# Altium project MaryLadder_8bits.PrjPcb
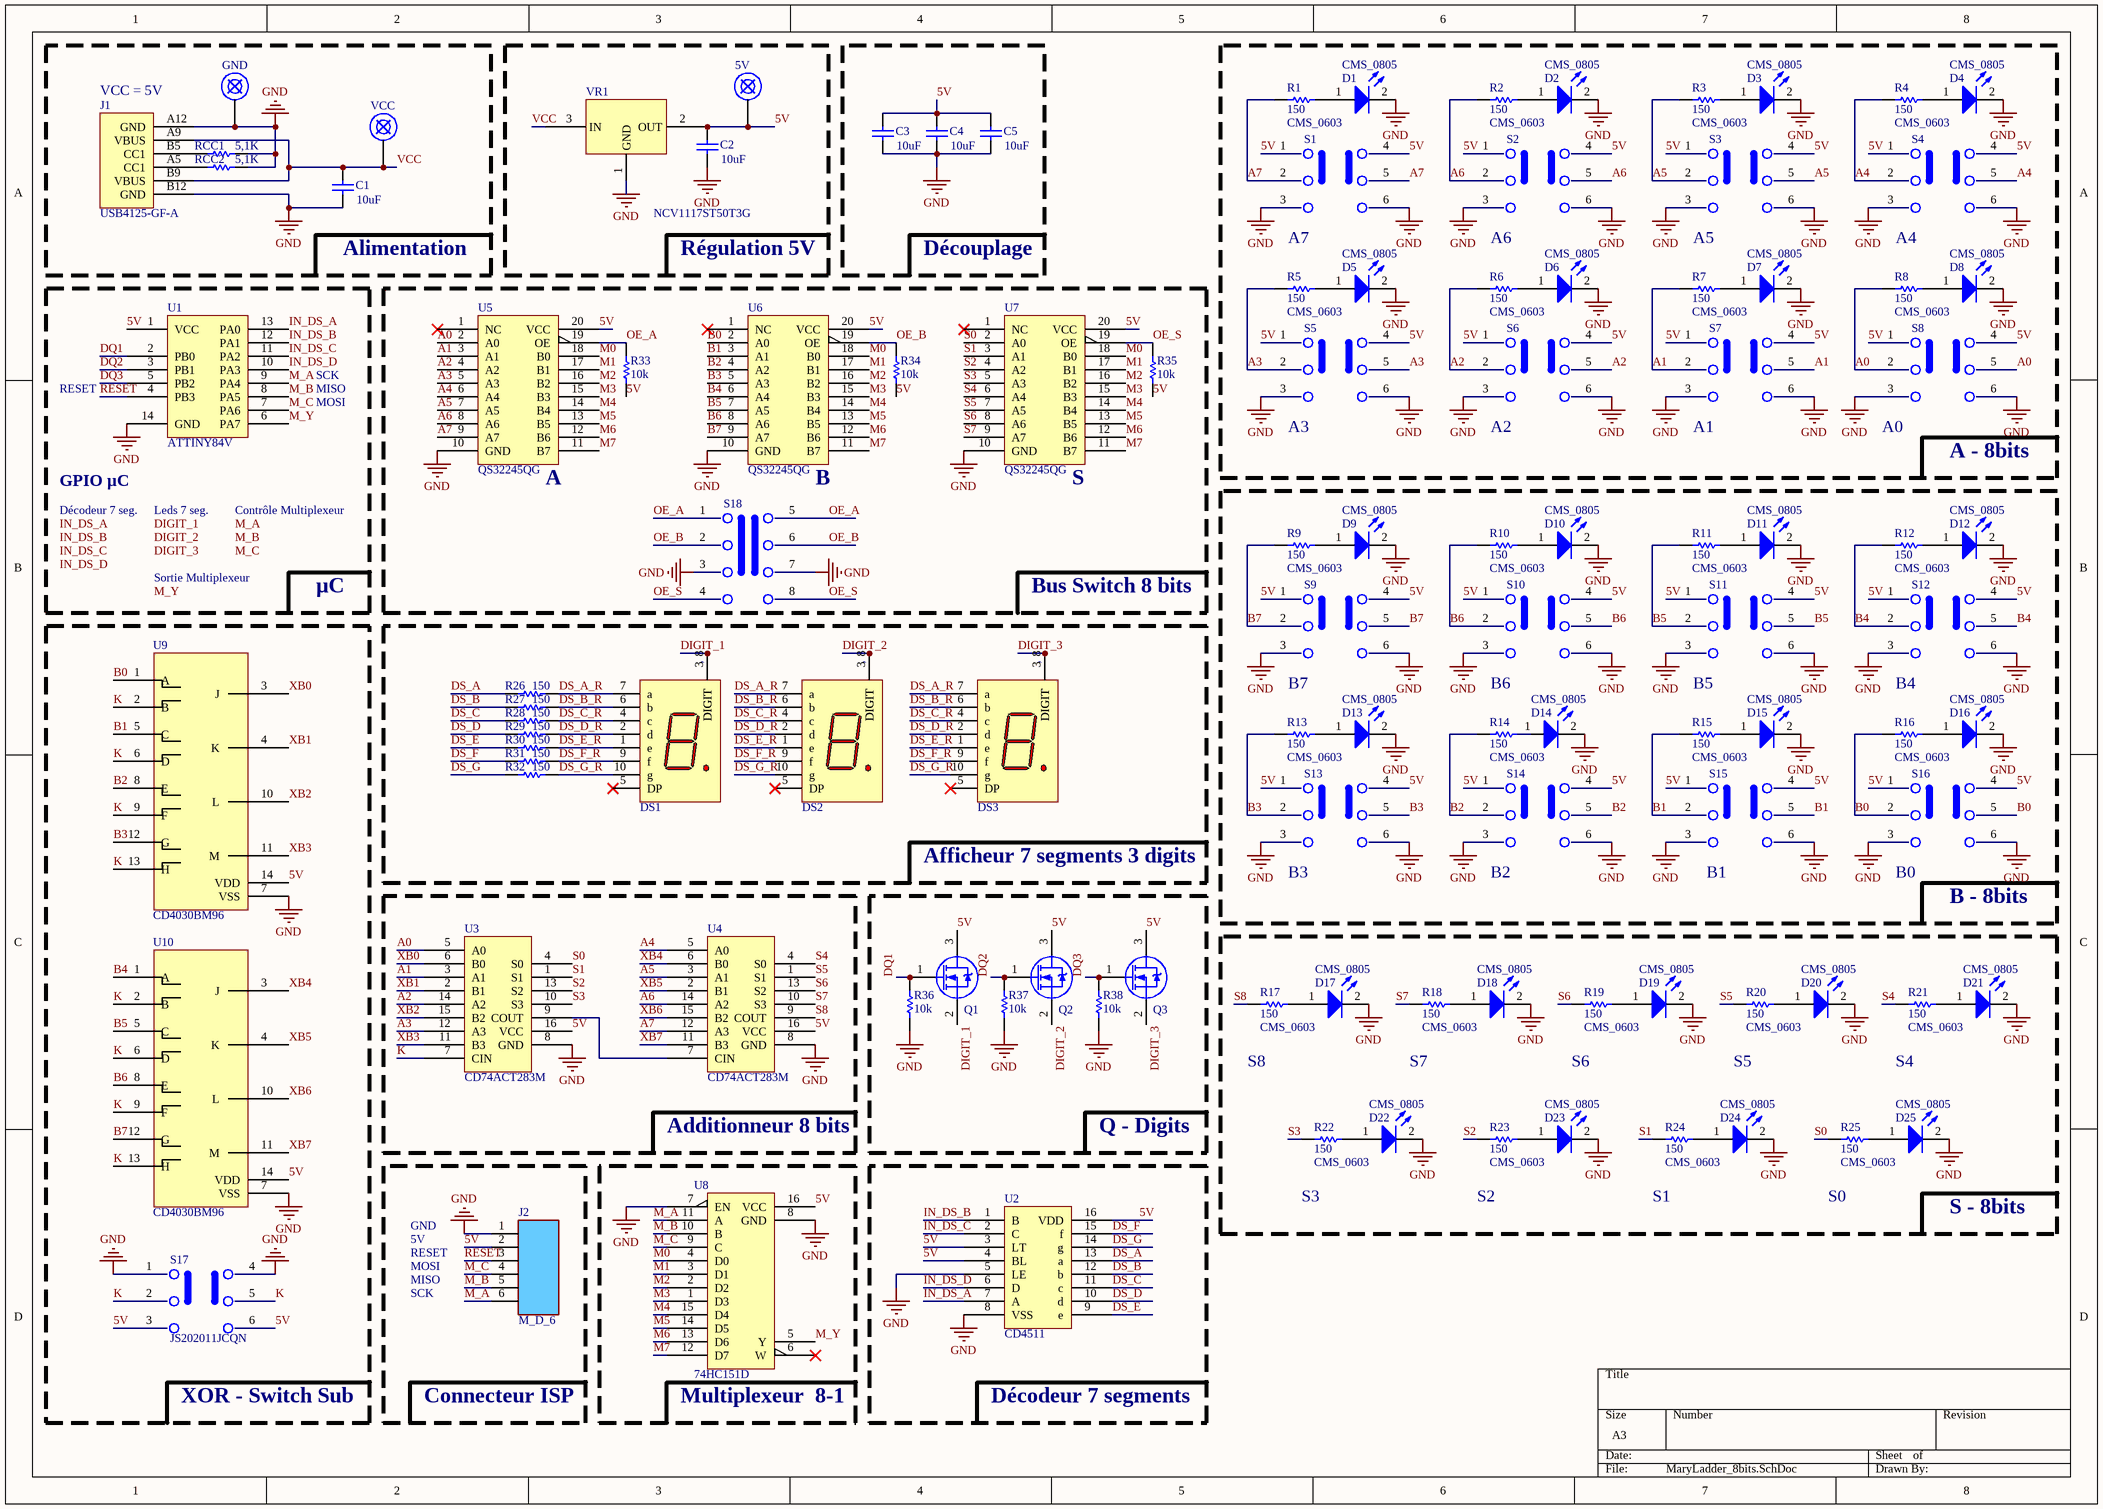
[diagram p0: MaryLadder_8bits.SchDoc]
1 sheet, 110 parts. Net scope: global (net labels, ports and power ports of the same name join across sheets).
Board file: MaryLadder_8bits.PcbDoc

## Sheet MaryLadder_8bits.SchDoc
size A3

### Parts
5V  POINT_TEST_CMS_2MM  [POINT_TEST_CMS_2MM]  (value not drawn)
C1  value 10uF  [CONDENSATEUR_CMS_0805]  (hidden comment: CMS_0805)
C2  value 10uF  [CONDENSATEUR_CMS_0805]  (hidden comment: CMS_0805)
C3  value 10uF  [CONDENSATEUR_CMS_0805]  (hidden comment: CMS_0805)
C4  value 10uF  [CONDENSATEUR_CMS_0805]  (hidden comment: CMS_0805)
C5  value 10uF  [CONDENSATEUR_CMS_0805]  (hidden comment: CMS_0805)
D1  Type: CMS_0805  [LED_CMS_0805]  (hidden comment: LED_CMS_0805)
D2  Type: CMS_0805  [LED_CMS_0805]  (hidden comment: LED_CMS_0805)
D3  Type: CMS_0805  [LED_CMS_0805]  (hidden comment: LED_CMS_0805)
D4  Type: CMS_0805  [LED_CMS_0805]  (hidden comment: LED_CMS_0805)
D5  Type: CMS_0805  [LED_CMS_0805]  (hidden comment: LED_CMS_0805)
D6  Type: CMS_0805  [LED_CMS_0805]  (hidden comment: LED_CMS_0805)
D7  Type: CMS_0805  [LED_CMS_0805]  (hidden comment: LED_CMS_0805)
D8  Type: CMS_0805  [LED_CMS_0805]  (hidden comment: LED_CMS_0805)
D9  Type: CMS_0805  [LED_CMS_0805]  (hidden comment: LED_CMS_0805)
D10  Type: CMS_0805  [LED_CMS_0805]  (hidden comment: LED_CMS_0805)
D11  Type: CMS_0805  [LED_CMS_0805]  (hidden comment: LED_CMS_0805)
D12  Type: CMS_0805  [LED_CMS_0805]  (hidden comment: LED_CMS_0805)
D13  Type: CMS_0805  [LED_CMS_0805]  (hidden comment: LED_CMS_0805)
D14  Type: CMS_0805  [LED_CMS_0805]  (hidden comment: LED_CMS_0805)
D15  Type: CMS_0805  [LED_CMS_0805]  (hidden comment: LED_CMS_0805)
D16  Type: CMS_0805  [LED_CMS_0805]  (hidden comment: LED_CMS_0805)
D17  Type: CMS_0805  [LED_CMS_0805]  (hidden comment: LED_CMS_0805)
D18  Type: CMS_0805  [LED_CMS_0805]  (hidden comment: LED_CMS_0805)
D19  Type: CMS_0805  [LED_CMS_0805]  (hidden comment: LED_CMS_0805)
D20  Type: CMS_0805  [LED_CMS_0805]  (hidden comment: LED_CMS_0805)
D21  Type: CMS_0805  [LED_CMS_0805]  (hidden comment: LED_CMS_0805)
D22  Type: CMS_0805  [LED_CMS_0805]  (hidden comment: LED_CMS_0805)
D23  Type: CMS_0805  [LED_CMS_0805]  (hidden comment: LED_CMS_0805)
D24  Type: CMS_0805  [LED_CMS_0805]  (hidden comment: LED_CMS_0805)
D25  Type: CMS_0805  [LED_CMS_0805]  (hidden comment: LED_CMS_0805)
DS1  AFFICHEUR_7_SEGM_A.C_1_DIGIT  [AFFICHEUR_7_SEGM_A.C_1_DIGIT]  (value not drawn)
DS2  AFFICHEUR_7_SEGM_A.C_1_DIGIT  [AFFICHEUR_7_SEGM_A.C_1_DIGIT]  (value not drawn)
DS3  AFFICHEUR_7_SEGM_A.C_1_DIGIT  [AFFICHEUR_7_SEGM_A.C_1_DIGIT]  (value not drawn)
GND  POINT_TEST_CMS_2MM  [POINT_TEST_CMS_2MM]  (value not drawn)
J1  USB4125-GF-A  [TYPE-C FEMELLE]
J2  Type: M_D_6  [BARRETTE_6_M_D]  (hidden comment: BARRETTE_6 CONTACTS_1 RANGEE_MALE_DROITE)
Q1  TRANSISTOR_MOSFET-N_SOT23_GSD  [TRANSISTOR_MOSFET-N_SOT23_GSD]  (value not drawn)
Q2  TRANSISTOR_MOSFET-N_SOT23_GSD  [TRANSISTOR_MOSFET-N_SOT23_GSD]  (value not drawn)
Q3  TRANSISTOR_MOSFET-N_SOT23_GSD  [TRANSISTOR_MOSFET-N_SOT23_GSD]  (value not drawn)
R1  value 150  Type: CMS_0603  [RESISTANCE_CMS_0603]  (hidden comment: RESISTANCE_CMS_0603)
R2  value 150  Type: CMS_0603  [RESISTANCE_CMS_0603]  (hidden comment: RESISTANCE_CMS_0603)
R3  value 150  Type: CMS_0603  [RESISTANCE_CMS_0603]  (hidden comment: RESISTANCE_CMS_0603)
R4  value 150  Type: CMS_0603  [RESISTANCE_CMS_0603]  (hidden comment: RESISTANCE_CMS_0603)
R5  value 150  Type: CMS_0603  [RESISTANCE_CMS_0603]  (hidden comment: RESISTANCE_CMS_0603)
R6  value 150  Type: CMS_0603  [RESISTANCE_CMS_0603]  (hidden comment: RESISTANCE_CMS_0603)
R7  value 150  Type: CMS_0603  [RESISTANCE_CMS_0603]  (hidden comment: RESISTANCE_CMS_0603)
R8  value 150  Type: CMS_0603  [RESISTANCE_CMS_0603]  (hidden comment: RESISTANCE_CMS_0603)
R9  value 150  Type: CMS_0603  [RESISTANCE_CMS_0603]  (hidden comment: RESISTANCE_CMS_0603)
R10  value 150  Type: CMS_0603  [RESISTANCE_CMS_0603]  (hidden comment: RESISTANCE_CMS_0603)
R11  value 150  Type: CMS_0603  [RESISTANCE_CMS_0603]  (hidden comment: RESISTANCE_CMS_0603)
R12  value 150  Type: CMS_0603  [RESISTANCE_CMS_0603]  (hidden comment: RESISTANCE_CMS_0603)
R13  value 150  Type: CMS_0603  [RESISTANCE_CMS_0603]  (hidden comment: RESISTANCE_CMS_0603)
R14  value 150  Type: CMS_0603  [RESISTANCE_CMS_0603]  (hidden comment: RESISTANCE_CMS_0603)
R15  value 150  Type: CMS_0603  [RESISTANCE_CMS_0603]  (hidden comment: RESISTANCE_CMS_0603)
R16  value 150  Type: CMS_0603  [RESISTANCE_CMS_0603]  (hidden comment: RESISTANCE_CMS_0603)
R17  value 150  Type: CMS_0603  [RESISTANCE_CMS_0603]  (hidden comment: RESISTANCE_CMS_0603)
R18  value 150  Type: CMS_0603  [RESISTANCE_CMS_0603]  (hidden comment: RESISTANCE_CMS_0603)
R19  value 150  Type: CMS_0603  [RESISTANCE_CMS_0603]  (hidden comment: RESISTANCE_CMS_0603)
R20  value 150  Type: CMS_0603  [RESISTANCE_CMS_0603]  (hidden comment: RESISTANCE_CMS_0603)
R21  value 150  Type: CMS_0603  [RESISTANCE_CMS_0603]  (hidden comment: RESISTANCE_CMS_0603)
R22  value 150  Type: CMS_0603  [RESISTANCE_CMS_0603]  (hidden comment: RESISTANCE_CMS_0603)
R23  value 150  Type: CMS_0603  [RESISTANCE_CMS_0603]  (hidden comment: RESISTANCE_CMS_0603)
R24  value 150  Type: CMS_0603  [RESISTANCE_CMS_0603]  (hidden comment: RESISTANCE_CMS_0603)
R25  value 150  Type: CMS_0603  [RESISTANCE_CMS_0603]  (hidden comment: RESISTANCE_CMS_0603)
R26  value 150  [RESISTANCE_CMS_0603]  (hidden comment: RESISTANCE_CMS_0603)
R27  value 150  [RESISTANCE_CMS_0603]  (hidden comment: RESISTANCE_CMS_0603)
R28  value 150  [RESISTANCE_CMS_0603]  (hidden comment: RESISTANCE_CMS_0603)
R29  value 150  [RESISTANCE_CMS_0603]  (hidden comment: RESISTANCE_CMS_0603)
R30  value 150  [RESISTANCE_CMS_0603]  (hidden comment: RESISTANCE_CMS_0603)
R31  value 150  [RESISTANCE_CMS_0603]  (hidden comment: RESISTANCE_CMS_0603)
R32  value 150  [RESISTANCE_CMS_0603]  (hidden comment: RESISTANCE_CMS_0603)
R33  value 10k  [RESISTANCE_CMS_0603]  (hidden comment: RESISTANCE_CMS_0603)
R34  value 10k  [RESISTANCE_CMS_0603]  (hidden comment: RESISTANCE_CMS_0603)
R35  value 10k  [RESISTANCE_CMS_0603]  (hidden comment: RESISTANCE_CMS_0603)
R36  value 10k  [RESISTANCE_CMS_0603]  (hidden comment: RESISTANCE_CMS_0603)
R37  value 10k  [RESISTANCE_CMS_0603]  (hidden comment: RESISTANCE_CMS_0603)
R38  value 10k  [RESISTANCE_CMS_0603]  (hidden comment: RESISTANCE_CMS_0603)
RCC1  value 5,1K  [RESISTANCE_CMS_0603]  (hidden comment: RESISTANCE_CMS_0603)
RCC2  value 5,1K  [RESISTANCE_CMS_0603]  (hidden comment: RESISTANCE_CMS_0603)
S1  JS202011JCQN  [JS202011JCQN]  (value not drawn)
S2  JS202011JCQN  [JS202011JCQN]  (value not drawn)
S3  JS202011JCQN  [JS202011JCQN]  (value not drawn)
S4  JS202011JCQN  [JS202011JCQN]  (value not drawn)
S5  JS202011JCQN  [JS202011JCQN]  (value not drawn)
S6  JS202011JCQN  [JS202011JCQN]  (value not drawn)
S7  JS202011JCQN  [JS202011JCQN]  (value not drawn)
S8  JS202011JCQN  [JS202011JCQN]  (value not drawn)
S9  JS202011JCQN  [JS202011JCQN]  (value not drawn)
S10  JS202011JCQN  [JS202011JCQN]  (value not drawn)
S11  JS202011JCQN  [JS202011JCQN]  (value not drawn)
S12  JS202011JCQN  [JS202011JCQN]  (value not drawn)
S13  JS202011JCQN  [JS202011JCQN]  (value not drawn)
S14  JS202011JCQN  [JS202011JCQN]  (value not drawn)
S15  JS202011JCQN  [JS202011JCQN]  (value not drawn)
S16  JS202011JCQN  [JS202011JCQN]  (value not drawn)
S17  JS202011JCQN  [JS202011JCQN]
S18  JS203011JCQN  [JS203011JCQN]  (value not drawn)
U1  ATTINY84V  [ATTINY84V-10SSU]
U2  CD4511  [CD4511]
U3  CD74ACT283M  [CD74ACT283M]
U4  CD74ACT283M  [CD74ACT283M]
U5  QS32245QG  [QS32245QG]
U6  QS32245QG  [QS32245QG]
U7  QS32245QG  [QS32245QG]
U8  74HC151D  [74HC151D]
U9  CD4030BM96  [CD4030BM96]
U10  CD4030BM96  [CD4030BM96]
VCC  POINT_TEST_CMS_2MM  [POINT_TEST_CMS_2MM]  (value not drawn)
VR1  NCV1117ST50T3G  [NCV1117ST50T3G]

### Blocks framed on the sheet
Alimentation: C1 GND J1 RCC1 RCC2 VCC
Régulation 5V: 5V C2 VR1
Découplage: C3-C5
A - 8bits: D1-D8 R1-R8 S1-S8
µC: U1
B - 8bits: D9-D16 R9-R16 S9-S16
XOR - Switch Sub: S17 U9 U10
Afficheur 7 segments 3 digits: DS1-DS3 R26-R32
Additionneur 8 bits: U3 U4
Q - Digits: Q1-Q3 R36-R38
S - 8bits: D17-D25 R17-R25
Connecteur ISP: J2
Multiplexeur  8-1: U8
Décodeur 7 segments: U2

### Nets
GND: C1.1 C2.1 C3.1 C4.1 C5.1 D1.2 D2.2 D3.2 D4.2 D5.2 D6.2 D7.2 D8.2 D9.2 D10.2 D11.2 D12.2 D13.2 D14.2 D15.2 D16.2 D17.2 D18.2 D19.2 D20.2 D21.2 D22.2 D23.2 D24.2 D25.2 GND.1 J1.A12(GND) J1.B12(GND) J2.1 R36.1 R37.1 R38.1 RCC1.2 RCC2.2 S1.3 S1.6 S2.3 S2.6 S3.3 S3.6 S4.3 S4.6 S5.3 S5.6 S6.3 S6.6 S7.3 S7.6 S8.3 S8.6 S9.3 S9.6 S10.3 S10.6 S11.3 S11.6 S12.3 S12.6 S13.3 S13.6 S14.3 S14.6 S15.3 S15.6 S16.3 S16.6 S17.1 S17.4 S18.3 S18.7 U1.14(GND) U2.5(LE) U2.8(VSS) U3.8(GND) U4.8(GND) U5.10(GND) U6.10(GND) U7.10(GND) U8.7(EN) U8.8(GND) U9.7(VSS) U10.7(VSS) VR1.1(GND)
5V: 5V.1 C2.2 C3.2 C4.2 C5.2 J2.2 Q1.3(D) Q2.3(D) Q3.3(D) R33.1 R34.1 R35.1 S1.1 S1.4 S2.1 S2.4 S3.1 S3.4 S4.1 S4.4 S5.1 S5.4 S6.1 S6.4 S7.1 S7.4 S8.1 S8.4 S9.1 S9.4 S10.1 S10.4 S11.1 S11.4 S12.1 S12.4 S13.1 S13.4 S14.1 S14.4 S15.1 S15.4 S16.1 S16.4 S17.3 S17.6 U1.1(VCC) U2.3(LT) U2.4(BL) U2.16(VDD) U3.16(VCC) U4.16(VCC) U5.20(VCC) U6.20(VCC) U7.20(VCC) U8.16(VCC) U9.14(VDD) U10.14(VDD) VR1.2(OUT)
A0: R8.1 S8.2 S8.5 U3.5(A0) U5.2(A0)
A1: R7.1 S7.2 S7.5 U3.3(A1) U5.3(A1)
A2: R6.1 S6.2 S6.5 U3.14(A2) U5.4(A2)
A3: R5.1 S5.2 S5.5 U3.12(A3) U5.5(A3)
A4: R4.1 S4.2 S4.5 U4.5(A0) U5.6(A4)
A5: R3.1 S3.2 S3.5 U4.3(A1) U5.7(A5)
A6: R2.1 S2.2 S2.5 U4.14(A2) U5.8(A6)
A7: R1.1 S1.2 S1.5 U4.12(A3) U5.9(A7)
B0: R16.1 S16.2 S16.5 U6.2(A0) U9.1(A)
B1: R15.1 S15.2 S15.5 U6.3(A1) U9.5(C)
B2: R14.1 S14.2 S14.5 U6.4(A2) U9.8(E)
B3: R13.1 S13.2 S13.5 U6.5(A3) U9.12(G)
B4: R12.1 S12.2 S12.5 U6.6(A4) U10.1(A)
B5: R11.1 S11.2 S11.5 U6.7(A5) U10.5(C)
B6: R10.1 S10.2 S10.5 U6.8(A6) U10.8(E)
B7: R9.1 S9.2 S9.5 U6.9(A7) U10.12(G)
DIGIT_1: DS1.3(DIGIT) DS1.8(DIGIT) Q1.2(S)
DIGIT_2: DS2.3(DIGIT) DS2.8(DIGIT) Q2.2(S)
DIGIT_3: DS3.3(DIGIT) DS3.8(DIGIT) Q3.2(S)
DQ1: Q1.1(G) R36.2 U1.2(PB0)
DQ2: Q2.1(G) R37.2 U1.3(PB1)
DQ3: Q3.1(G) R38.2 U1.5(PB2)
DS_A: R26.1 U2.13(a)
DS_A_R: DS1.7(a) DS2.7(a) DS3.7(a) R26.2
DS_B: R27.1 U2.12(b)
DS_B_R: DS1.6(b) DS2.6(b) DS3.6(b) R27.2
DS_C: R28.1 U2.11(c)
DS_C_R: DS1.4(c) DS2.4(c) DS3.4(c) R28.2
DS_D: R29.1 U2.10(d)
DS_D_R: DS1.2(d) DS2.2(d) DS3.2(d) R29.2
DS_E: R30.1 U2.9(e)
DS_E_R: DS1.1(e) DS2.1(e) DS3.1(e) R30.2
DS_F: R31.1 U2.15(f)
DS_F_R: DS1.9(f) DS2.9(f) DS3.9(f) R31.2
DS_G: R32.1 U2.14(g)
DS_G_R: DS1.10(g) DS2.10(g) DS3.10(g) R32.2
IN_DS_A: U1.13(PA0) U2.7(A)
IN_DS_B: U1.12(PA1) U2.1(B)
IN_DS_C: U1.11(PA2) U2.2(C)
IN_DS_D: U1.10(PA3) U2.6(D)
K: S17.2 S17.5 U3.7(CIN) U9.2(B) U9.6(D) U9.9(F) U9.13(H) U10.2(B) U10.6(D) U10.9(F) U10.13(H)
M0: U5.18(B0) U6.18(B0) U7.18(B0) U8.4(D0)
M1: U5.17(B1) U6.17(B1) U7.17(B1) U8.3(D1)
M2: U5.16(B2) U6.16(B2) U7.16(B2) U8.2(D2)
M3: U5.15(B3) U6.15(B3) U7.15(B3) U8.1(D3)
M4: U5.14(B4) U6.14(B4) U7.14(B4) U8.15(D4)
M5: U5.13(B5) U6.13(B5) U7.13(B5) U8.14(D5)
M6: U5.12(B6) U6.12(B6) U7.12(B6) U8.13(D6)
M7: U5.11(B7) U6.11(B7) U7.11(B7) U8.12(D7)
M_A: J2.6 U1.9(PA4) U8.11(A)
M_B: J2.5 U1.8(PA5) U8.10(B)
M_C: J2.4 U1.7(PA6) U8.9(C)
M_Y: U1.6(PA7) U8.5(Y)
OE_A: R33.2 S18.1 S18.5 U5.19(OE)
OE_B: R34.2 S18.2 S18.6 U6.19(OE)
OE_S: R35.2 S18.4 S18.8 U7.19(OE)
RESET: J2.3 U1.4(PB3)
S0: R25.1 U3.4(S0) U7.2(A0)
S1: R24.1 U3.1(S1) U7.3(A1)
S2: R23.1 U3.13(S2) U7.4(A2)
S3: R22.1 U3.10(S3) U7.5(A3)
S4: R21.1 U4.4(S0) U7.6(A4)
S5: R20.1 U4.1(S1) U7.7(A5)
S6: R19.1 U4.13(S2) U7.8(A6)
S7: R18.1 U4.10(S3) U7.9(A7)
S8: R17.1 U4.9(COUT)
VCC: C1.2 J1.A9(VBUS) J1.B9(VBUS) VCC.1 VR1.3(IN)
XB0: U3.6(B0) U9.3(J)
XB1: U3.2(B1) U9.4(K)
XB2: U3.15(B2) U9.10(L)
XB3: U3.11(B3) U9.11(M)
XB4: U4.6(B0) U10.3(J)
XB5: U4.2(B1) U10.4(K)
XB6: U4.15(B2) U10.10(L)
XB7: U4.11(B3) U10.11(M)
NetD1_1: D1.1 R1.2
NetD2_1: D2.1 R2.2
NetD3_1: D3.1 R3.2
NetD4_1: D4.1 R4.2
NetD5_1: D5.1 R5.2
NetD6_1: D6.1 R6.2
NetD7_1: D7.1 R7.2
NetD8_1: D8.1 R8.2
NetD9_1: D9.1 R9.2
NetD10_1: D10.1 R10.2
NetD11_1: D11.1 R11.2
NetD12_1: D12.1 R12.2
NetD13_1: D13.1 R13.2
NetD14_1: D14.1 R14.2
NetD15_1: D15.1 R15.2
NetD16_1: D16.1 R16.2
NetD17_1: D17.1 R17.2
NetD18_1: D18.1 R18.2
NetD19_1: D19.1 R19.2
NetD20_1: D20.1 R20.2
NetD21_1: D21.1 R21.2
NetD22_1: D22.1 R22.2
NetD23_1: D23.1 R23.2
NetD24_1: D24.1 R24.2
NetD25_1: D25.1 R25.2
NetJ1_A5: J1.A5(CC1) RCC2.1
NetJ1_B5: J1.B5(CC1) RCC1.1
NetU3_9: U3.9(COUT) U4.7(CIN)

Not connected (* = marked no-connect by the designer): DS1 5(DP)*; DS2 5(DP)*; DS3 5(DP)*; U5 1(NC)*; U6 1(NC)*; U7 1(NC)*; U8 6(W)*

### Notes on the sheet
- (near J1) VCC = 5V
- (near S1) A7
- (near S2) A6
- (near S3) A5
- (near S4) A4
- SCK
- RESET
- MISO
- MOSI
- (near S5) A3
- (near S6) A2
- (near S7) A1
- (near S8) A0
- GPIO µC
- Décodeur 7 seg.
- Leds 7 seg.
- Contrôle Multiplexeur
- (near U5) A
- B
- (near U7) S
- Sortie Multiplexeur
- Bus Switch 8 bits
- (near S9) B7
- (near S10) B6
- (near S11) B5
- (near S12) B4
- (near S13) B3
- (near S14) B2
- (near S15) B1
- (near S16) B0
- (near R17) S8
- S7
- S6
- S5
- S4
- 5V
- GND
- (near R22) S3
- (near R23) S2
- (near R24) S1
- (near R25) S0
- Labels drawn without touching a wire or pin: DIGIT_1, DIGIT_2, DIGIT_3, IN_DS_A, IN_DS_B, IN_DS_C, IN_DS_D, M_A, M_B, M_C, M_Y
- (in symbol AFFICHEUR_7_SEGM_A.C_1_DIGIT) ,

### Library data of the parts
C1-C5 = CONDENSATEUR_CMS_CER_0805: CONDENSATEUR CMS CERAMIQUE 0805; Type: CMS_0805
D1-D25 = LED_CMS_0805: LED CMS 0805
DS1-DS3 = AFFICHEUR_7_SEGM_A.C_1_DIGIT: VDMR10A1 - DISPLAY 7SEG 0.39" SGL RED 10SMD; Type: SMD-10
J1 = TYPE-C FEMELLE: CONN RCPT TYPE C 6P SMD RA
J2 = BARRETTE_6 CONTACTS_1 RANGEE_MALE_DROITE: BARRETTE 6 CONTACTS 1 RANGEE MALE DROITE
Q1-Q3 = TRANSISTOR_MOSFET-N_SOT23_GSD: TRANSISTOR MOSFET CANAL N BOITIER SOT23_GSD; Package: N_SOT23
R1-R38 RCC1 RCC2 = RESISTANCE_CMS_0603: RESISTANCE CMS 0603
  R26-R38 RCC1 RCC2: Type: CMS_0603
S1-S17 = JS202011JCQN: SWITCH SLIDE DPDT 300MA 6V
S18 = JS203011JCQN: SWITCH SLIDE DP3T 300MA 6V
U1 = ATTINY84V-10SSU: AVR series Microcontrôleurs IC 8 bits 10MHz 8Ko (4K x 16) FLASH 14-SOIC; Type: SOIC-14
U2 = CD4511: CMOS BCD to 7 Segment Latch Decoder Drivers
U3 U4 = CD74ACT283M: 4-Bit Binary Fill Adder With Fast Carry; Type: SOIC-16
U5-U7 = QS32245QG: IC BUS SWITCH 1 X 8:1 20QSOP; Type: QSOP-20
U8 = 74HC151D: IC MULTIPLEXER 1 X 8:1; Type: SOIC-16
U9 U10 = CD4030BM96: IC GATE XOR 4CH 2-INP 14SOIC
VR1 = NCV1117ST50T3G: IC REG LINEAR 5V 1A SOT223; Type: SOT-223